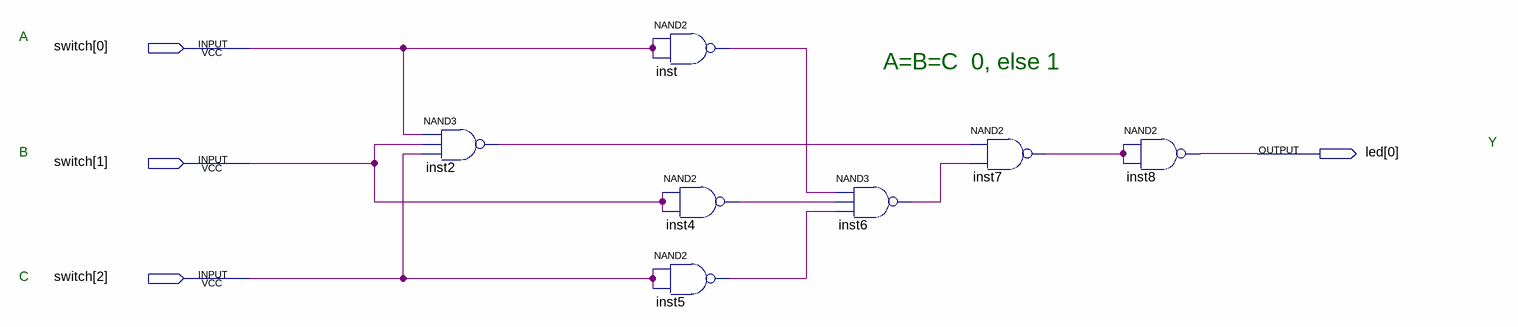
[diagram p0: schematic sheet]
// Quartus schematic pj303.bdf as structural Verilog: 7 symbols, 4 pins
module pj303 (
  input  [2:0] switch,
  output [0:0] led
);

  wire inst2_out, inst4_out, inst5_out, inst6_out, inst7_out, inst_out;

  nand inst2 (inst2_out, switch[0], switch[1], switch[2]);
  nand inst (inst_out, switch[0], switch[0]);
  nand inst4 (inst4_out, switch[1], switch[1]);
  nand inst5 (inst5_out, switch[2], switch[2]);
  nand inst6 (inst6_out, inst_out, inst4_out, inst5_out);
  nand inst7 (inst7_out, inst2_out, inst6_out);
  nand inst8 (led[0], inst7_out, inst7_out);

  // Notes on the sheet:
  //   A
  //   A=B=C  0, else 1
  //   Y
  //   B
  //   C
endmodule
